# Altium project Voltage Divider For Oscilloscope Probe v2.0.PrjPcb
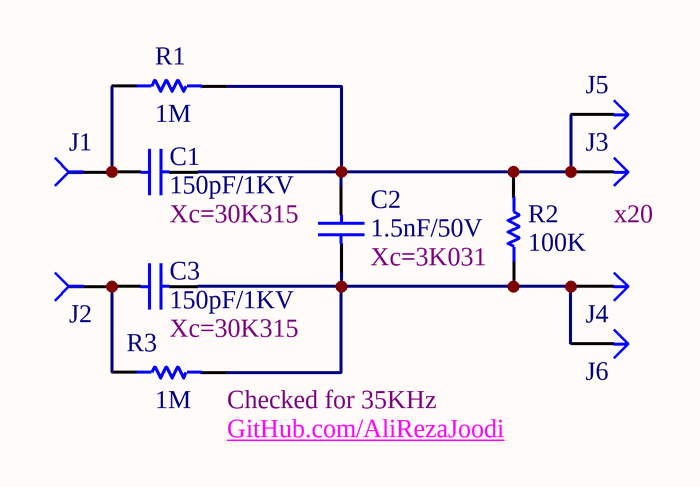
[diagram p0: Main.SchDoc]
1 sheet, 12 parts. Net scope: global (net labels, ports and power ports of the same name join across sheets).
Board file: PCB.PcbDoc

## Sheet Main.SchDoc
size 58 x 38 mm

### Parts
C1  150pF/1KV  [THD_P15/L18/W4]
C2  1.5nF/50V  [THD_P7.6/L10/W5.5/H9]
C3  150pF/1KV  [THD_P15/L18/W4]
J1  Connector_Socket_1Pin_Female_2Form  [THD_C_BLK3]  (value not drawn)
J2  Connector_Socket_1Pin_Female_2Form  [THD_C_BLK3]  (value not drawn)
J3  Connector_Socket_1Pin_Male_2Form  [THD_C_BLK2]  (value not drawn)
J4  Connector_Socket_1Pin_Male_2Form  [THD_C_BLK2]  (value not drawn)
J5  Connector_Socket_1Pin_Male_2Form  [THD_C_BLK2]  (value not drawn)
J6  Connector_Socket_1Pin_Male_2Form  [THD_C_BLK2]  (value not drawn)
R1  1M  [THD_AXIAL0.4]
R2  100K  [THD_AXIAL0.4]
R3  1M  [THD_AXIAL0.4]

### Nets
NetC1_1: C1.1 C2.2 J3.1(A) J5.1(A) R1.1 R2.1
NetC1_2: C1.2 J1.1(A) R1.2
NetC2_1: C2.1 C3.1 J4.1(A) J6.1(A) R2.2 R3.1
NetC3_2: C3.2 J2.1(A) R3.2

### Notes on the sheet
- (near C1) Xc=30K315
- (near J3) x20
- Xc=30K315
- Xc=3K031
- (near R3) GitHub.com/AliRezaJoodi
- (near R3) Checked for 35KHz

### Library data of the parts
C1 C3 = Capacitor_Ceramic: Capacitor, MKT; Revision: July-2002: Re-released for DXP Platform.
C2 = Capacitor_Ceramic: Capacitor, Polyester; Revision: July-2002: Re-released for DXP Platform.
J1 J2 = Connector_Socket_1Pin_Female_2Form: Connector, Socket, 1Pin; Revision: July-2002: Re-released for DXP Platform.
J3-J6 = Connector_Socket_1Pin_Male_2Form: Connector, Socket, 1Pin; Revision: July-2002: Re-released for DXP Platform.
R1-R3 = Resistor_2Form: Resistor, 1/4W, 5%; Revision: July-2002: Re-released for DXP Platform.